# EAGLE design SMARTBALL_v2.1 (EAGLE 9.6.2)
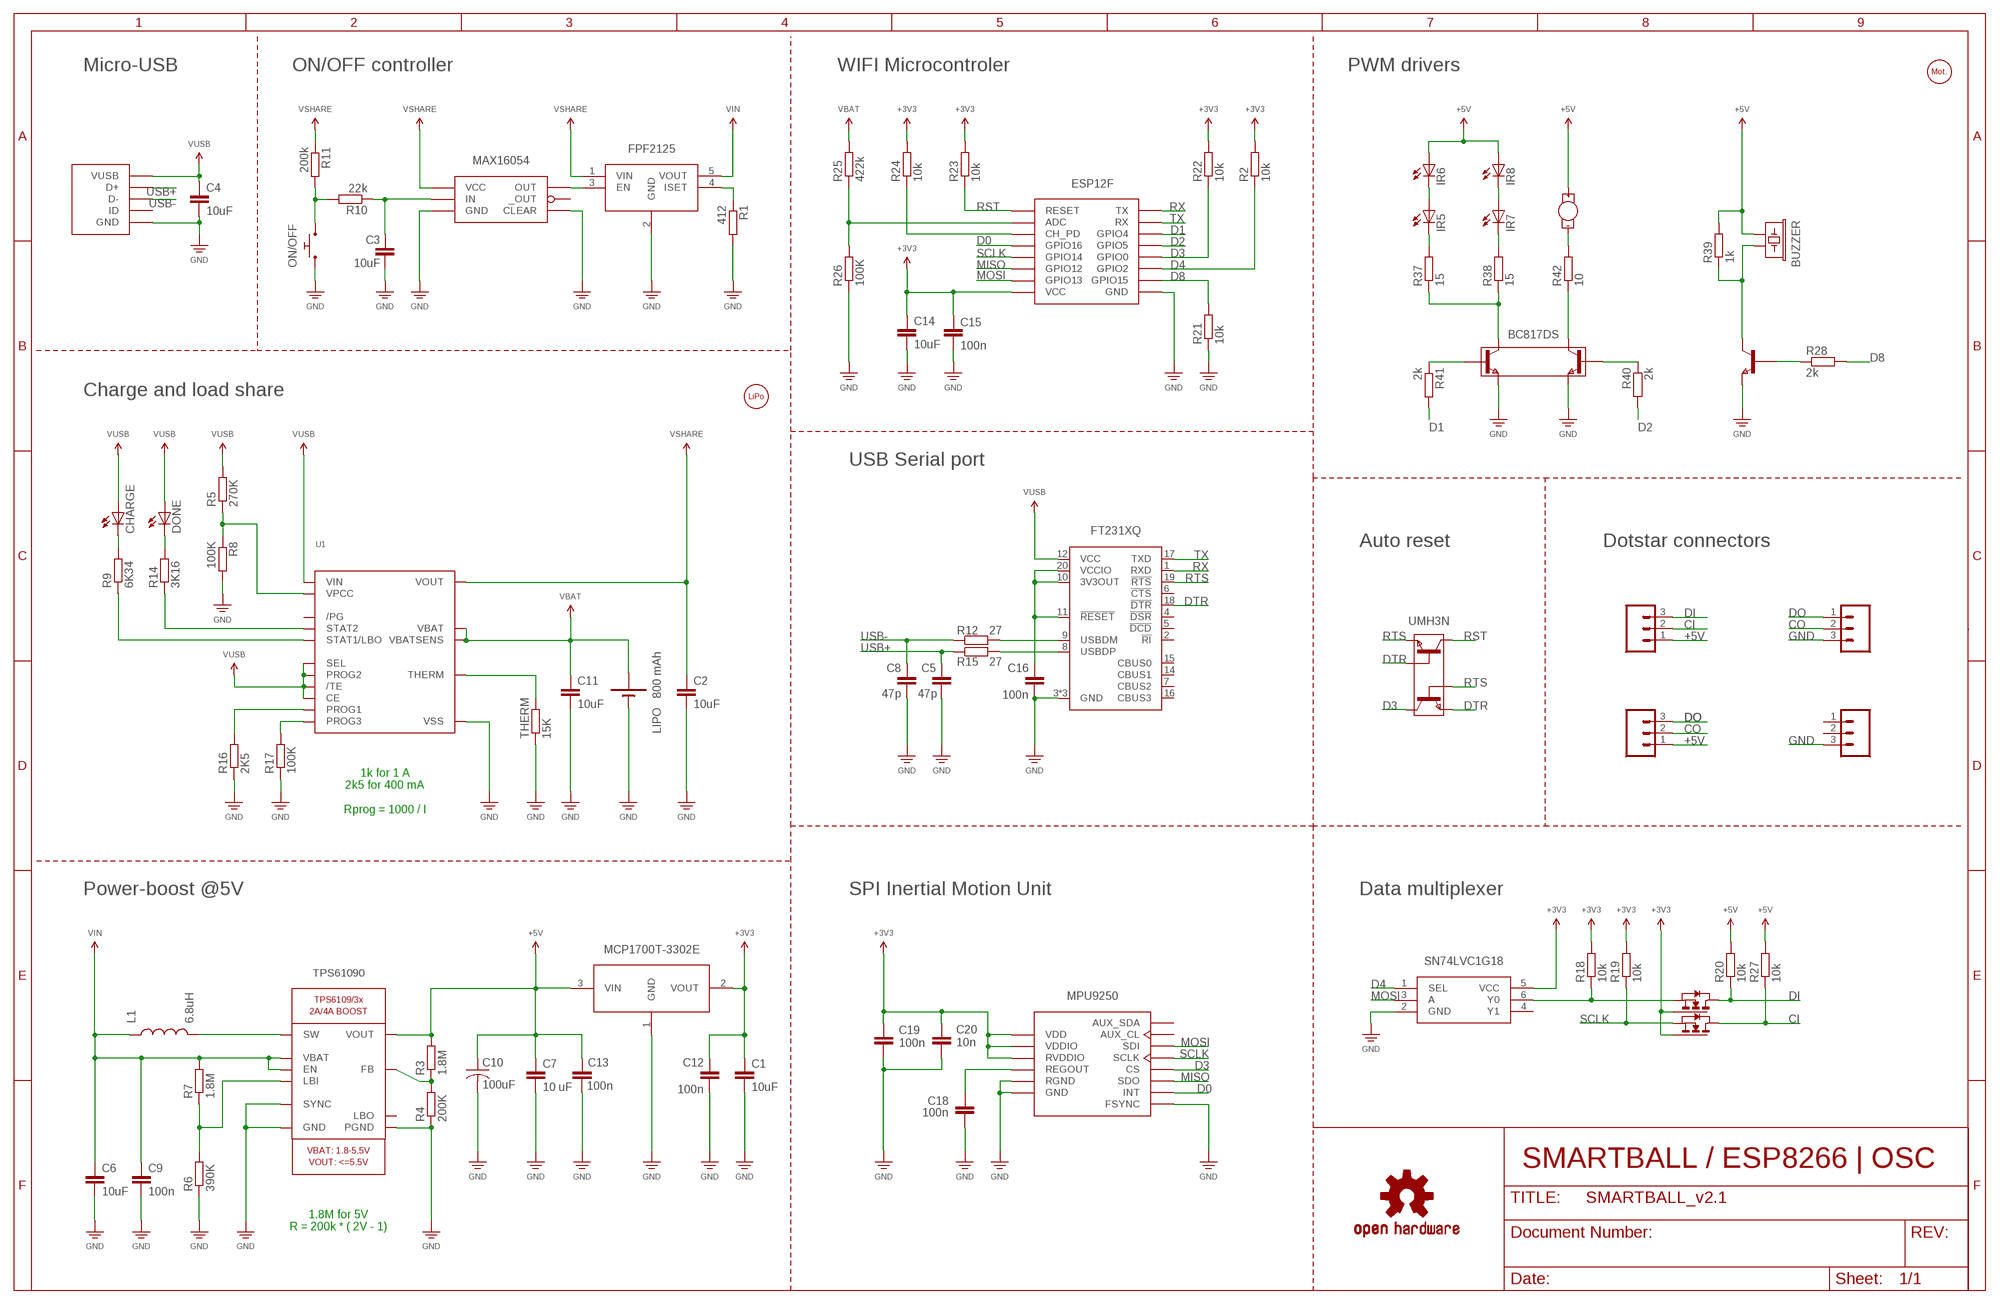
[diagram p0: schematic, sheet 1]

## Parts
BC817DS  SOT_BC817DS  [SOT457R_PHILIPS]
BUZZER  BUZZER_PKMCS0909E4000-R1  [BUZZER_PKMCS0909E4000-R1]
C1  10uF  CAP_CERAMICC0603K  [C0603]
C2  10uF  CAP_CERAMICC0603K  [C0603]
C3  10uF  CAP_CERAMICC0603K  [C0603]
C4  10uF  CAP_CERAMICC0603K  [C0603]
C5  47p  CAP_CERAMICC0603K  [C0603]
C6  10uF  CAP_CERAMICC0603K  [C0603]
C7  10 uF  CAP_CERAMICC0603K  [C0603]
C8  47p  CAP_CERAMICC0603K  [C0603]
C9  100n  CAP_CERAMICC0603K  [C0603]
C10  100uF  CAP_TANTALUMC1210  [C1210]
C11  10uF  CAP_CERAMICC0603K  [C0603]
C12  100n  CAP_CERAMICC0603K  [C0603]
C13  100n  CAP_CERAMICC0603K  [C0603]
C14  10uF  CAP_CERAMICC0603K  [C0603]
C15  100n  CAP_CERAMICC0603K  [C0603]
C16  100n  CAP_CERAMICC0603K  [C0603]
C18  100n  CAP_CERAMICC0603K  [C0603]
C19  100n  CAP_CERAMICC0603K  [C0603]
C20  10n  CAP_CERAMICC0603K  [C0603]
CHARGE  LED_KINGBRIGHT_16X08  [LED_KINGBRIGHT_16X08]
DONE  LED_KINGBRIGHT_16X08  [LED_KINGBRIGHT_16X08]
ESP12F  µP_ESP12  [µP_ESP12]
FT231XQ  QFN_FT231X  [QFN20]
IR5  LED_SFH4050  [LED_SFH4050]
IR6  LED_SFH4050  [LED_SFH4050]
IR7  LED_SFH4050  [LED_SFH4050]
IR8  LED_SFH4050  [LED_SFH4050]
L1  6.8uH  IND_ASPIAIG-S4035  [IND_ASPIAIG-S4035]
LIPO  CONN_BATTERY  [CONN_WIRES]
LOGO1  LOGO_OSHWL  [LOGO_OSHW]
MOTOR  CONN_MOTOR  [CONN_WIRES]
ON/OFF  BUT_KMR6  [BUT_KMR6]
R1  412  RES_EUR0402  [R0402]
R2  10k  RES_EUR0402  [R0402]
R3  1.8M  RES_EUR0402  [R0402]
R4  200K  RES_EUR0402  [R0402]
R5  270K  RES_EUR0402  [R0402]
R6  390K  RES_EUR0402  [R0402]
R7  1.8M  RES_EUR0402  [R0402]
R8  100K  RES_EUR0402  [R0402]
R9  6K34  RES_EUR0402  [R0402]
R10  22k  RES_EUR0402  [R0402]
R11  200k  RES_EUR0402  [R0402]
R12  27  RES_EUR0402  [R0402]
R14  3K16  RES_EUR0402  [R0402]
R15  27  RES_EUR0402  [R0402]
R16  2K5  RES_EUR0402  [R0402]
R17  100K  RES_EUR0402  [R0402]
R18  10k  RES_EUR0402  [R0402]
R19  10k  RES_EUR0402  [R0402]
R20  10k  RES_EUR0402  [R0402]
R21  10k  RES_EUR0402  [R0402]
R22  10k  RES_EUR0402  [R0402]
R23  10k  RES_EUR0402  [R0402]
R24  10k  RES_EUR0402  [R0402]
R25  422k  RES_EUR0402  [R0402]
R26  100K  RES_EUR0402  [R0402]
R27  10k  RES_EUR0402  [R0402]
R28  2k  RES_EUR0402  [R0402]
R37  15  RES_EUR0402  [R0402]
R38  15  RES_EUR0402  [R0402]
R39  1k  RES_EUR0402  [R0402]
R40  2k  RES_EUR0402  [R0402]
R41  2k  RES_EUR0402  [R0402]
R42  10  RES_EUR0402  [R0402]
THERM  15K  RES_EUR0402  [R0402]
TPS61090  TPS61090RSAR  QFN_TPS6103X  [QFN16]
U1  QFN_MCP73871  [QFN20]
U$1  CONN_USB  [CONN_USB]
U$2  SOT_FPF2125  [SOT23-5]
U$3  SOT_MCP1700T  [SOT23-3]
U$5  CONN_03_SMD  [CONN_03_SMD]
U$6  CONN_03_SMD  [CONN_03_SMD]
U$12  SOT_MAX16054  [TSOT23-6]
U$14  CONN_03_SMD  [CONN_03_SMD]
U$15  CONN_03_SMD  [CONN_03_SMD]
U$19  MOTOR_BODY  [MOTOR_BODY]
U$20  SOT_SN74LVC1G18  [SOT363]
U$21  QFN_MPU-9250QFN24G  [QFN24_3MM]
U$22  SOT_2N7002PS  [SOT363]
U$28  SOT_SBC847AWT1G  [SOT323]
U$29  BATT_BODY  [BATT_BODY]
UMH3N  SOT_UMH3N  [SOT363]

## Nets
+3V3 [+3v3]: C1.1 C12.1 C14.1 C15.1 C19.1 C20.2 ESP12F.VCC R2.2 R18.2 R19.2 R22.2 R23.2 R24.2 U$3.2(VOUT) U$20.5(VCC) U$21.1(RVDDIO) U$21.8(VDDIO) U$21.13(VDD) U$22.2(G1) U$22.5(G2)
+5V [power]: BUZZER.1 C7.1 C10.1 C13.1 IR6.1(A) IR8.1(A) MOTOR.VCC(+) R3.2 R20.2 R27.2 R39.2 TPS61090.1(VOUT) TPS61090.15(VOUT) TPS61090.16(VOUT) U$3.3(VIN) U$5.1 U$15.1
ADC: ESP12F.ADC R25.1 R26.2
B1: BC817DS.5(B2) R41.1
B2: BC817DS.2(B1) R40.1
B3: R28.1 U$28.1(B)
C1: BC817DS.3(C2) R37.1 R38.1
C2: BC817DS.6(C1) R42.1
C3: BUZZER.2 R39.1 U$28.3(C)
CI: R27.1 U$5.2 U$22.3(D2)
CO: U$6.2 U$15.2
D0: ESP12F.GPIO16 U$21.12(INT)
D1: ESP12F.GPIO4 R41.2
D2: ESP12F.GPIO5 R40.2
D3: ESP12F.GPIO0 R22.1 U$21.22(CS) UMH3N.3(C2)
D4: ESP12F.GPIO2 R2.1 U$20.1(SEL)
D8: ESP12F.GPIO15 R21.2 R28.2
DI: R20.1 U$5.3 U$22.6(D1)
DO: U$6.1 U$15.3
DTR: FT231XQ.18(!DTR) UMH3N.2(B1) UMH3N.4(E2)
EN: U$2.3(EN) U$12.5(OUT)
EN1: ESP12F.CH_PD R24.1
FB: R3.1 R4.2 TPS61090.14(FB)
GND [power]: BC817DS.1(E1) BC817DS.4(E2) C1.2 C2.2 C3.2 C4.2 C5.2 C6.2 C7.2 C8.2 C9.2 C10.2 C11.2 C12.2 C13.2 C14.2 C15.2 C16.2 C18.2 C19.2 C20.1 ESP12F.GND FT231XQ.3(GND) FT231XQ.13(GND) FT231XQ.EXP(GND) LIPO.GND ON/OFF.1 ON/OFF.4 R1.2 R4.1 R6.1 R8.2 R16.1 R17.1 R21.1 R26.1 THERM.1 TPS61090.5(PGND) TPS61090.6(PGND) TPS61090.7(PGND) TPS61090.10(SYNC) TPS61090.13(GND) TPS61090.PAD(PGND) U1.10(VSS) U1.11(VSS) U1.EXP(VSS) U$1.GND U$1.P$1(GND) U$1.P$11(GND) U$1.SHELL1(GND) U$1.SHELL2(GND) U$1.SHELL5(GND) U$1.SHELL6(GND) U$2.2(GND) U$3.1(GND) U$6.3 U$12.2(GND) U$12.3(CLEAR) U$14.3 U$20.2(GND) U$21.11(FSYNC) U$21.18(GND) U$21.20(RGND) U$28.2(E)
IN: C3.1 R10.1 U$12.1(IN)
IR1: IR5.2(C) R37.2
IR2: IR5.1(A) IR6.2(C)
IR3: IR7.1(A) IR8.2(C)
IR4: IR7.2(C) R38.2
ISET: R1.1 U$2.4(ISET)
LBI: R6.2 R7.1 TPS61090.9(LBI)
LED1: DONE.2(C) R14.2
LED2: CHARGE.2(C) R9.2
MISO: ESP12F.GPIO12 U$21.9(SDO)
MOSI: ESP12F.GPIO13 U$20.3(A) U$21.24(SDI)
MOT: MOTOR.GND(-) R42.2
ON/OFF: ON/OFF.2 ON/OFF.3 R10.2 R11.2
PROG1: R16.2 U1.13(PROG1)
PROG3: R17.2 U1.12(PROG3)
REGOUT1: C18.1 U$21.10(REGOUT)
RST: ESP12F.RESET R23.1 UMH3N.6(C1)
RTS: FT231XQ.19(!RTS) UMH3N.1(E1) UMH3N.5(B2)
RX: ESP12F.TX FT231XQ.1(RXD)
SCLK: ESP12F.GPIO14 R19.1 U$21.23(SCLK) U$22.4(S2)
STAT1: R9.1 U1.8(STAT1/LBO)
STAT2: R14.1 U1.7(STAT2)
SW: L1.2 TPS61090.3(SW) TPS61090.4(SW)
THERM: THERM.2 U1.5(THERM)
TX: ESP12F.RX FT231XQ.17(TXD)
USB+: C5.1 R15.1 U$1.D+
USB-: C8.1 R12.1 U$1.D-
USBDM: FT231XQ.9(USBDM) R12.2
USBDP: FT231XQ.8(USBDP) R15.2
VBAT [power]: C11.1 LIPO.VCC(VBAT) R25.2 U1.14(VBAT) U1.15(VBAT) U1.16(VBATSENS)
VCCIO1: C16.1 FT231XQ.10(3V3OUT) FT231XQ.11(!RESET) FT231XQ.20(VCCIO)
VIN [power]: C6.1 C9.1 L1.1 R7.2 TPS61090.8(VBAT) TPS61090.11(EN) U$2.5(VOUT)
VPCC: R5.1 R8.1 U1.2(VPCC)
VSHARE [power]: C2.1 R11.1 U1.1(VOUT) U1.20(VOUT) U$2.1(VIN) U$12.6(VCC)
VUSB [power]: C4.1 CHARGE.1(A) DONE.1(A) FT231XQ.12(VCC) R5.2 U1.3(SEL) U1.4(PROG2) U1.9(/TE) U1.17(CE) U1.18(VIN) U1.19(VIN) U$1.VUSB
Y0: R18.1 U$20.6(Y0) U$22.1(S1)
Unconnected: FT231XQ.2(!RI) FT231XQ.4(!DSR) FT231XQ.5(!DCD) FT231XQ.6(!CTS) FT231XQ.7(CBUS2) FT231XQ.14(CBUS1) FT231XQ.15(CBUS0) FT231XQ.16(CBUS3) TPS61090.12(LBO) U1.6(/PG) U$1.ID U$12.4(_OUT) U$14.1 U$14.2 U$20.4(Y1) U$21.7(AUX_CL) U$21.21(AUX_SDA)

## Notes on the sheet
- Micro-USB | ON/OFF controller | WIFI Microcontroler | PWM drivers
- FPF2125
- MAX16054
- Charge and load share
- USB Serial port
- Auto reset | Dotstar connectors
- 800 mAh
- 1k for 1 A
  2k5 for 400 mA
  
  Rprog = 1000 / I
- Power-boost @5V | SPI Inertial Motion Unit | Data multiplexer
- MCP1700T-3302E
- SN74LVC1G18
- SMARTBALL / ESP8266 | OSC
- 1.8M for 5V
  R = 200k * ( 2V - 1)

## Library data of the parts
BC817DS = Smartball:SOT_BC817DS: Dual NPN Transistor
BUZZER = Smartball:BUZZER_PKMCS0909E4000-R1: Piezzo Buzzer
C1-C9 C11-C16 C18-C20 = Smartball:CAP_CERAMIC: Ceramic Capacitor; SPICEPREFIX: C
C10 = Smartball:CAP_TANTALUM: Tantalum Capacitor
CHARGE DONE = Smartball:LED_KINGBRIGHT_16X08: SMD Color LED
ESP12F = Smartball:µP_ESP12: ESP8266 Wifi module 12F
FT231XQ = Smartball:QFN_FT231X: Serial USB Interface
IR5-IR8 = Smartball:LED_SFH4050: 850 nm High Power IR Led from OSRAM
L1 = Smartball:IND_ASPIAIG-S4035: Inductor
LIPO = Smartball:CONN_BATTERY: LIPO PCB Connector
LOGO1 = Smartball:LOGO_OSHW: Open-Source Hardware (OSHW) Logo This logo indicates the piece of hardware it is found on incorporates a OSHW license and/or adheres to the definition of open source hardware found here: http://freedomdefined.org/OSHW
MOTOR = Smartball:CONN_MOTOR: Motor PCB Connector
ON/OFF = Smartball:BUT_KMR6: Momentary Switch
R1-R12 R14-R28 R37-R42 THERM = Smartball:RES_EU: Resistor; SPICEPREFIX: R
TPS61090 = Smartball:QFN_TPS6103X: Power Booster 1.8-5.5V Input, Adjustable Output to 5.5V
U1 = Smartball:QFN_MCP73871: Lithium Polymer Battery Charger
U$1 = Smartball:CONN_USB: Micro USB Connector
U$2 = Smartball:SOT_FPF2125: Overcurrent Protection
U$3 = Smartball:SOT_MCP1700T: 3.3V Voltage Regulator
U$5 U$6 U$14 U$15 = Smartball:CONN_03_SMD: SMD 3-Pin Connector
U$12 = Smartball:SOT_MAX16054: Smart On/Off Controller
U$19 = Smartball:MOTOR_BODY: Motor Body
U$20 = Smartball:SOT_SN74LVC1G18: 1 Channel Multiplexer
U$21 = Smartball:QFN_MPU-9250: MPU-9250 Invensense IMU Chipset
U$22 = Smartball:SOT_2N7002PS
U$28 = Smartball:SOT_SBC847AWT1G: NPN Transistor
U$29 = Smartball:BATT_BODY: Battery Body
UMH3N = Smartball:SOT_UMH3N: Autoreset dual-channel NPN Transistor

## Net classes
0 default: width 0.152 mm
1 power: width 0.254 mm
2 +3v3: width 0.203 mm

## Board
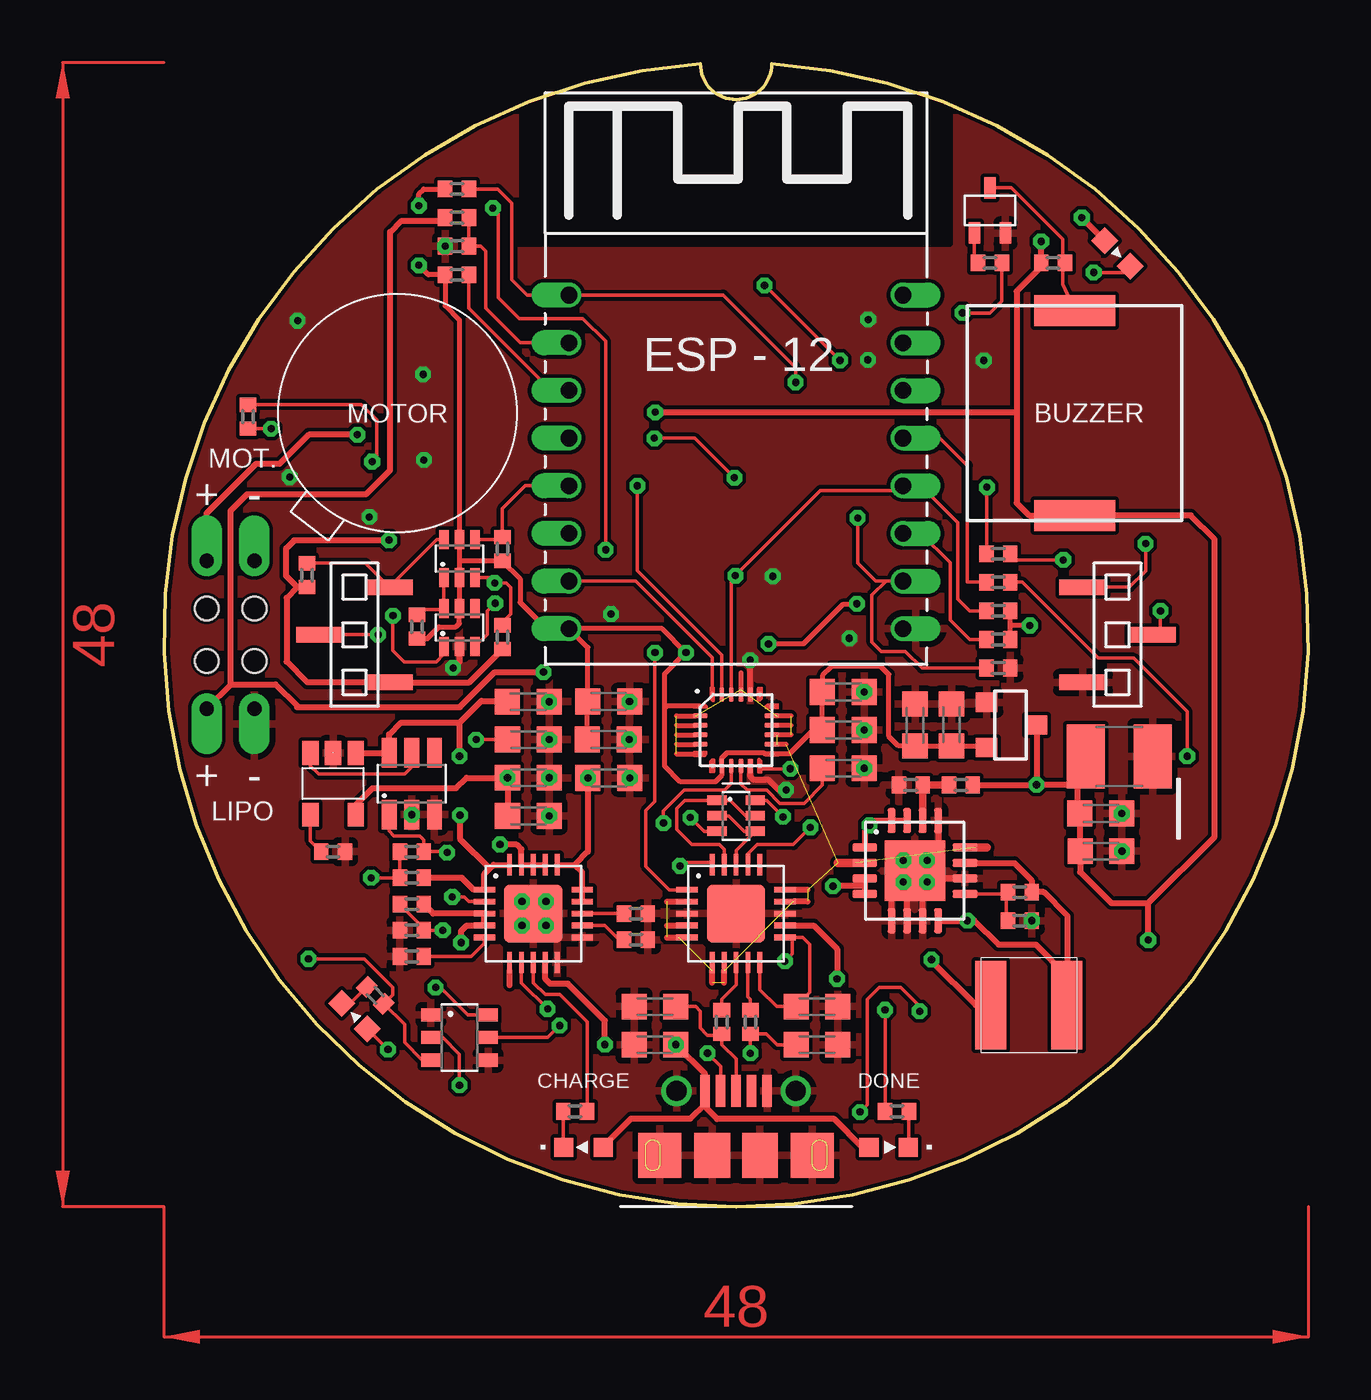
[diagram p1: board, top side]
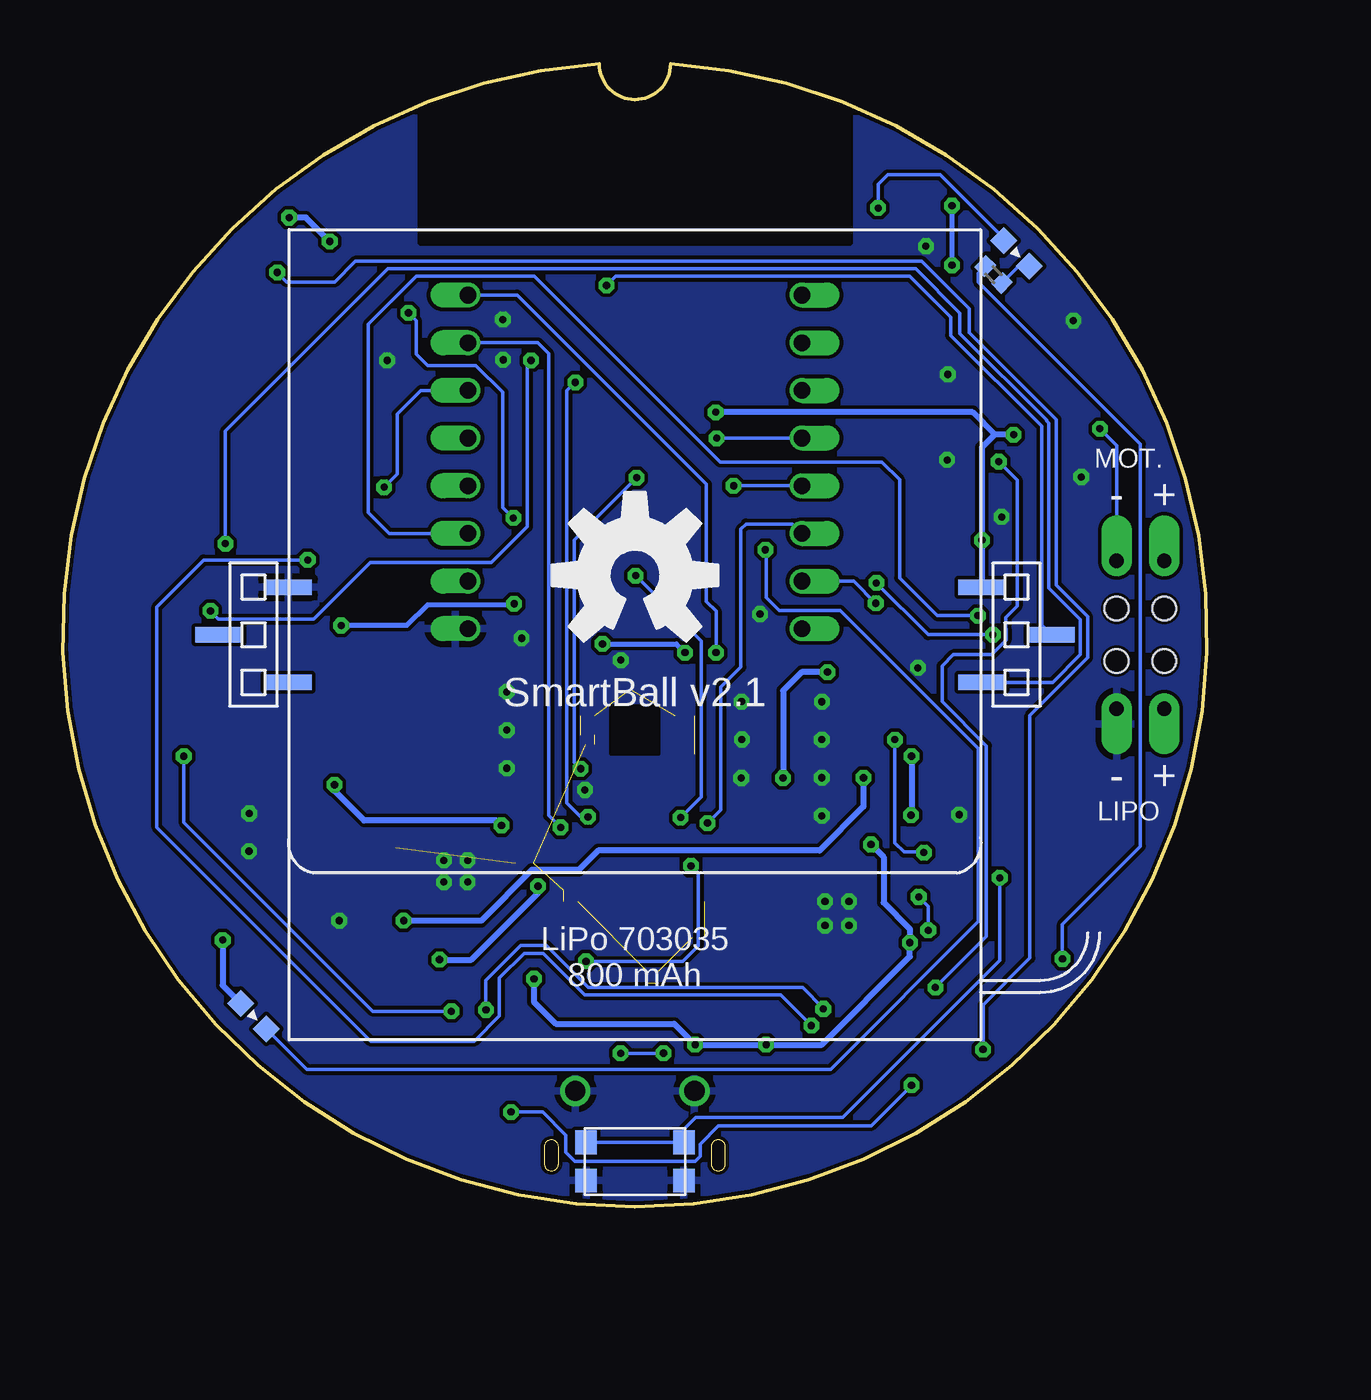
[diagram p2: board, bottom side, seen from below]

Size 47.98 x 47.96 mm. Coordinates in mm from the lower left corner, seen from the top.
Outline: 22.5,47.96 arc353 25.49,47.96 arc-180 22.5,47.96
Copper layers (1*16): Top 0.035mm / dielectric 1.5mm / Bottom 0.035mm
Design rules "PCBWay-LIMIT *": minimum track width 6mil, minimum drill 0.3mm, track to track 6mil, track to pad 6mil, pad to pad 6mil, via to via 6mil, smd to smd 6mil, copper to edge 6mil, drill to drill 6mil, minimum pad ring 7mil, minimum via ring 7mil, stop-mask expansion 4mil, vias tented up to drill 25mil, thermal gap 10mil

### Footprints (pad centres in the part's own frame; a part is rotated, then mirrored left to right if it is on the bottom)
SOT457R_PHILIPS = smd 0.55 x 0.8: 1 -0.95,-1.2; 2 0,-1.2; 3 0.95,-1.2; 4 0.95,1.2; 5 0,1.2; 6 -0.95,1.2
BUZZER_PKMCS0909E4000-R1 = smd 1.3 x 3.4: 1 -4.3,0; 2 4.3,0
C0603 = smd 1.05 x 1.08: 1 -0.875,0; 2 0.875,0
C1210 = smd 1.6 x 2.7: 1 -1.4,0; 2 1.4,0
LED_KINGBRIGHT_16X08 = smd 0.8 x 0.8: 1 -0.825,0; 2 0.825,0
µP_ESP12 = drill 0.7 offset: ADC -7,3.8; CH_PD -7,1.8; GND 7,-8.2; GPIO0 7,-2.2; GPIO2 7,-4.2; GPIO4 7,1.8; GPIO5 7,-0.2; GPIO12 -7,-4.2; GPIO13 -7,-6.2; GPIO14 -7,-2.2; GPIO15 7,-6.2; GPIO16 -7,-0.2; RESET -7,5.8; RX 7,3.8; TX 7,5.8; VCC -7,-8.2
QFN20 = smd 0.95 x 0.25: 1 -2.05,1; 2 -2.05,0.5; 3 -2.05,0; 4 -2.05,-0.5; 5 -2.05,-1; 11 2.05,-1; 12 2.05,-0.5; 13 2.05,0; 14 2.05,0.5; 15 2.05,1 | smd 0.25 x 0.9: 6 -1,-2.05; 7 -0.5,-2.05; 8 0,-2.05; 9 0.5,-2.05; 10 1,-2.05; 16 1,2.05; 17 0.5,2.05; 18 0,2.05; 19 -0.5,2.05; 20 -1,2.05 | smd 2.45 x 2.45: EXP 0,0
LED_SFH4050 = smd 0.8 x 0.8: 1 -0.75,0; 2 0.75,0
IND_ASPIAIG-S4035 = smd 1.3 x 3.7: 1 -1.6,0; 2 1.6,0
CONN_WIRES = drill 0.6 pad 1.27 offset: GND 1,0; VCC -1,0 | hole 1: -1,-2; 1,-2
BUT_KMR6 = smd 0.9 x 1: 1 -2.05,0.8; 2 -2.05,-0.8; 3 2.05,-0.8; 4 2.05,0.8
R0402 = smd 0.6 x 0.7: 1 -0.5,0; 2 0.5,0
QFN16 = smd 1.05 x 0.35: 1 -2.1,0.975; 2 -2.1,0.325; 3 -2.1,-0.325; 4 -2.1,-0.975; 9 2.1,-0.975; 10 2.1,-0.325; 11 2.1,0.325; 12 2.1,0.975 | smd 0.35 x 1.05: 5 -0.975,-2.1; 6 -0.325,-2.1; 7 0.325,-2.1; 8 0.975,-2.1; 13 0.975,2.1; 14 0.325,2.1; 15 -0.325,2.1; 16 -0.975,2.1 | smd 2.54 x 2.54: PAD 0,0
CONN_USB = smd 0.4 x 1.35: D+ 0,2.7; D- -0.65,2.7; GND 1.3,2.7; ID 0.65,2.7; VUSB -1.3,2.7 | smd 1.8 x 1.9: P$1 -3.2,0; P$11 3.2,0 | drill 0.85: SHELL1 -2.5,2.7; SHELL2 2.5,2.7 | smd 1.5 x 1.9: SHELL5 -1,0; SHELL6 1,0
SOT23-5 = smd 0.69 x 0.99: 1 -0.95,-1.29; 2 0,-1.29; 3 0.95,-1.29; 4 0.95,1.3; 5 -0.95,1.3
SOT23-3 = smd 0.8 x 0.9: 1 -0.95,-1; 2 0.95,-1; 3 0,1.1
CONN_03_SMD = smd 0.65 x 2: 1 -2,-1.45; 2 0,1.45; 3 2,-1.45
TSOT23-6 = smd 0.62 x 1.22: 1 -0.95,-1.3; 2 0,-1.3; 3 0.95,-1.3; 4 0.95,1.3; 5 0,1.3; 6 -0.95,1.3
SOT363 = smd 0.4 x 0.8: 1 -0.65,-0.8; 2 0,-0.8; 3 0.65,-0.8; 4 0.65,0.8; 5 0,0.8; 6 -0.65,0.8
QFN24_3MM = smd 0.2 x 0.15: 1 -1.5,1; 6 -1.5,-1; 13 1.5,-1; 18 1.5,1 | smd 0.6 x 0.2: 2 -1.5,0.6; 3 -1.5,0.2; 4 -1.5,-0.2; 5 -1.5,-0.6; 14 1.5,-0.6; 15 1.5,-0.2; 16 1.5,0.2; 17 1.5,0.6 | smd 0.15 x 0.2: 7 -1,-1.5; 12 1,-1.5; 19 1,1.5; 24 -1,1.5 | smd 0.2 x 0.6: 8 -0.6,-1.5; 9 -0.2,-1.5; 10 0.2,-1.5; 11 0.6,-1.5; 20 0.6,1.5; 21 0.2,1.5; 22 -0.2,1.5; 23 -0.6,1.5
SOT323 = smd 0.5 x 0.9: 1 -0.65,-0.95; 2 0.65,-0.95; 3 0,0.95

### Placement (x,y rotation side)
BC817DS  12.39,7.11 270 top
BUZZER  38.19,33.31 90 top
C1  33.03,20.23 90 top
C2  15.28,21.2 0 top
C3  15.28,19.61 0 top
C4  20.59,6.81 180 top
C5  20.59,8.41 180 top
C6  15.28,16.41 0 top
C7  39.29,16.51 0 top
C8  27.39,6.81 0 top
C9  15.28,18.01 0 top
C10  40.06,18.9 0 top
C11  18.66,18 0 top
C12  31.5,20.22 90 top
C13  39.3,14.93 0 top
C14  18.63,19.61 0 top
C15  18.65,21.2 0 top
C16  27.39,8.41 0 top
C18  28.49,18.41 0 top
C19  28.49,20.01 0 top
C20  28.49,21.61 180 top
CHARGE  17.59,2.51 180 top
DONE  30.39,2.51 0 top
ESP12F  23.99,32.46 0 top
FT231XQ  23.99,12.31 0 top
IR5  7.99,8.01 135 top
IR6  39.99,40.01 315 top
IR7  7.99,40.01 315 bottom
IR8  39.99,8.01 315 bottom
L1  36.27,8.47 180 top
LIPO  2.79,20.91 180 bottom
LOGO1  23.99,26.51 0 bottom
MOTOR  2.79,27.11 0 top
ON/OFF  23.99,1.91 180 bottom
R1  7.09,14.91 0 top
R2  34.99,23.81 0 top
R3  33.42,17.71 0 top
R4  31.32,17.71 0 top
R5  10.39,12.71 0 top
R6  35.89,12.01 180 top
R7  35.89,13.21 0 top
R8  10.39,11.61 180 top
R9  17.24,4.01 180 top
R10  10.39,14.91 180 top
R11  10.39,13.81 180 top
R12  24.59,7.76 90 top
R14  30.74,4.01 0 top
R15  23.39,7.76 90 top
R16  19.79,12.31 180 top
R17  19.79,11.21 180 top
R18  10.61,24.35 270 top
R19  14.19,27.61 270 top
R20  5.99,26.51 270 top
R21  34.99,22.61 180 top
R22  34.99,25.01 0 top
R23  12.29,42.71 180 top
R24  12.29,39.11 180 top
R25  12.29,41.51 180 top
R26  12.29,40.31 0 top
R27  14.19,23.91 270 top
R28  34.64,39.61 0 top
R37  8.86,8.88 135 top
R38  8.95,39.12 315 bottom
R39  37.29,39.61 180 top
R40  34.99,26.21 180 top
R41  34.99,27.41 180 top
R42  3.52,33.16 270 top
THERM  10.39,10.51 0 top
TPS61090  31.49,14.11 0 top
U1  15.49,12.31 0 top
U$1  23.99,2.17 0 top
U$2  7.09,17.76 180 top
U$3  35.5,20.23 270 top
U$5  7.99,24.01 90 top
U$6  39.99,24.01 270 top
U$12  10.39,17.76 0 top
U$14  39.99,24.01 90 bottom
U$15  7.99,24.01 270 bottom
U$19  9.79,33.31 0 top
U$20  12.39,24.31 0 top
U$21  23.99,20.01 0 top
U$22  12.39,27.21 0 top
U$28  34.64,41.81 0 top
U$29  23.99,24.01 0 bottom
UMH3N  23.99,16.41 270 top

### Tracks (layer width: path | path; a pad name or v marks a point on that pad's centre or on a via)
+3V3  (via drill 0.3, 0.3 pad 0.55)
  Top 0.203: U$21.13 26.23,19.01 27.23,20.01 C19.1 C20.2 27.62,22.3 28,22.68 30.06,22.68 30.4,22.34 30.4,19.74 30.8,19.34 C12.1 C1.1 34.42,19.35 U$3.2 | R2.2 35.49,24.4 | 35.49,24.4 R22.2 | 12.39,27.11 U$22.5 12.39,37.21 11.79,37.81 R24.2 11.09,39.11 v10.69,39.51 | 12.39,27.11 U$22.2 U$20.5 12.39,24.49 12.24,24.34 11.53,24.34 11.05,23.85 R18.2 | v29.06,25.31 29.02,25.27 28.46,25.27 26.82,23.62 v25.35,23.62 | v10.69,42.01 10.69,42.51 10.89,42.71 R23.2 | 20.99,20.91 20.99,18.51 21.66,17.84 23.12,17.84 23.39,18.11 U$21.8 23.39,18.84 23.62,19.07 25.15,19.07 25.21,19.01 U$21.13 | 20.99,20.91 20.99,22.36 v21.89,23.26 20.89,24.26 ESP12F.VCC | 20.99,20.91 21.09,21.01 U$21.1 | 12.39,27.11 R19.2 14.94,26.36 14.94,25.36 16.04,24.26 ESP12F.VCC | ESP12F.VCC 17.77,23.48 C15.1 17.76,21.19 C14.1 | v36.31,24.4 35.49,24.4 | U$21.13
  Bottom 0.203: v29.06,25.31 29.11,25.26 32.69,25.26 33.55,24.4 v36.31,24.4 | v25.35,23.62 22.25,23.62 v21.89,23.26 | v10.69,39.51 v10.69,42.01
+5V  (via drill 0.3, 0.3 pad 0.55)
  Top 0.254: 35.76,33.31 35.76,38.42 36.79,39.45 R39.2 v36.79,40.51 | 35.76,33.31 35.76,29.54 36.29,29.01 BUZZER.1 43.07,29.01 44.06,28.02 44.06,15.53 41.28,12.75 | 29.61,16 29.39,15.77 TPS61090.1 | 29.61,16 29.83,16.21 TPS61090.16 TPS61090.15 | v38.49,41.51 IR6.1 | IR6.1 | 29.61,16 v29.6,16.01 v29.59,16.01 | R27.2 14.23,23.37 14.17,23.37 12.81,22.01 U$5.1 6.01,22.01 5.14,22.88 5.14,25.56 5.59,26.01 | R20.2 5.59,26.01 | 5.59,26.01 5.12,26.48 5.12,27.63 5.46,27.97 9.43,27.97 v9.44,27.98 | MOTOR.VCC 1.79,29.11 3.85,31.17 4.84,31.17 6.07,32.4 v8.11,32.4 | U$3.3 v36.6,17.73 v36.59,17.72 | R3.2 v36.58,17.71 v36.59,17.72 | v36.59,17.72 38.33,17.72 | C10.1 38.66,18.05 38.33,17.72 | 38.33,17.72 38.33,16.6 C7.1 38.42,14.94 C13.1 38.43,14.05 39.73,12.75 41.28,12.75 | v41.28,11.2 41.28,12.75 | v20.6,33.34 35.72,33.34 35.76,33.31
  Bottom 0.254: v36.79,40.51 37.79,41.51 v38.49,41.51 | v41.28,11.2 41.28,9.3 IR8.1 | U$15.1 v9.44,27.98 9.44,31.86 8.9,32.4 | v8.11,32.4 8.9,32.4 | 8.9,32.4 8.89,32.41 9.83,33.34 v20.6,33.34 | v29.59,16.01 29.79,16.21 35.35,16.21 36.59,17.45 v36.59,17.72
ADC
  Top 0.152: R25.1 R26.2 13.29,40.31 13.49,40.11 13.49,37.71 14.94,36.26 ESP12F.ADC
B1  (via drill 0.3 pad 0.55)
  Top 0.152: BC817DS.5 16.09,7.11 v16.59,7.61 | v37.71,27.15 35.75,27.15 R41.1
  Bottom 0.152: v16.59,7.61 17.88,8.9 26.09,8.9 27.83,10.65 28.64,10.65 29.67,9.61 29.67,8.01 30.73,6.95 35.06,6.95 44.04,15.93 44.04,25.18 42.08,27.15 v37.71,27.15
B2  (via drill 0.3 pad 0.55)
  Top 0.152: BC817DS.2 11.69,7.11 12.39,6.41 v12.39,5.11 | v29.19,3.99 29.49,4.29 29.49,8.71 29.99,9.21 30.89,9.21 31.69,8.41 v31.69,8.21 | v42.91,18.91 42.91,20.79 40.67,23.03 39.18,23.03 36,26.21 R40.1
  Bottom 0.152: v12.39,5.11 14.09,3.41 20.49,3.41 21.26,2.64 21.26,2.11 21.47,1.91 26.51,1.91 26.89,2.29 26.89,3.01 27.87,3.99 v29.19,3.99 | v31.69,8.21 34.98,8.21 42.91,16.14 v42.91,18.91
B3
  Top 0.152: R28.1 33.99,39.76 U$28.1
C1  (via drill 0.3 pad 0.55)
  Top 0.152: BC817DS.3 10.84,6.16 10.09,6.91 10.09,7.65 R37.1 9.59,8.9 9.59,9.21 8.39,10.41 v6.06,10.41
  Bottom 0.152: R38.1 9.59,39.19 9.59,38.81 2.79,32.01 2.79,15.13 6.06,11.86 v6.06,10.41
C2  (via drill 0.3 pad 0.55)
  Top 0.152: BC817DS.6 12.74,8.06 11.59,9.21 v11.39,9.21 | v8.73,31.27 8.92,31.46 8.92,33.03 8.28,33.66 R42.1
  Bottom 0.152: v11.39,9.21 9.25,11.35 9.25,19.34 11.11,21.21 11.11,22.7 10.64,23.17 9.03,23.17 8.42,23.78 8.42,24.24 8.43,24.25 8.43,24.74 7.96,25.21 7.96,30.5 v8.73,31.27
C3
  Top 0.152: R39.1 37.69,39.71 | 37.69,39.71 37.69,40.61 35.54,42.76 U$28.3 | BUZZER.2 37.69,38.71 37.69,39.71
CI  (via drill 0.3 pad 0.55)
  Top 0.152: R27.1 14.19,24.52 14.55,24.88 14.55,25.99 14.35,26.18 v13.87,26.18 13.64,26.41 U$22.3 | v8.98,24.01 U$5.2
  Bottom 0.152: v13.87,26.18 11.69,24.01 v8.98,24.01
CO  (via drill 0.3 pad 0.55)
  Top 0.152: v28.35,35.52 25.2,38.67 v25.18,38.67 | U$6.2 41.79,24.01 v41.79,25.01
  Bottom 0.152: v41.79,25.01 41.46,24.68 37.45,24.68 35.1,27.03 30.02,27.03 28.51,28.54 28.51,35.36 v28.35,35.52 | v25.18,38.67 24.8,39.05 12.47,39.05 10.75,37.33 10.75,36.57 6.94,32.76 6.94,24.41 U$15.2
D0  (via drill 0.3 pad 0.55)
  Top 0.152: v23.92,30.6 22.26,32.26 v20.56,32.26 | v26.27,18.39 25.11,18.39 U$21.12
  Bottom 0.152: v26.27,18.39 26.53,18.65 26.53,27.99 v23.92,30.6 | v20.56,32.26 ESP12F.GPIO16
D1  (via drill 0.3)
  Top 0.152: v34.51,30.2 34.51,27.43 R41.2
  Bottom 0.152: ESP12F.GPIO4 32.97,34.26 33.97,33.26 33.97,30.74 v34.51,30.2
D2
  Top 0.152: R40.2 33.69,26.21 33.69,31.11 32.54,32.26 ESP12F.GPIO5
D3  (via drill 0.3 pad 0.55)
  Top 0.152: R22.1 33.79,25.01 33.29,25.51 33.29,28.71 31.69,30.31 30.94,30.31 ESP12F.GPIO0 30.69,30.06 27.53,30.06 v23.96,26.49 23.79,26.32 U$21.22 | UMH3N.3 22.66,15.76 v22.08,16.34
  Bottom 0.152: v22.08,16.34 21.21,17.21 21.21,23.74 v23.96,26.49
D4  (via drill 0.3 pad 0.55)
  Top 0.152: R2.1 33.79,23.81 32.97,24.63 32.97,27.03 31.74,28.26 ESP12F.GPIO2 | v9.6,24.81 9.6,23.34 10.07,22.87 11.41,22.87 11.74,23.2 U$20.1
  Bottom 0.152: ESP12F.GPIO2 34.3,28.26 35.17,29.13 35.17,37.04 33.16,39.05 28.21,39.05 20.42,31.26 13.64,31.26 12.89,30.51 12.89,26.39 11.31,24.81 v9.6,24.81
D8  (via drill 0.3 pad 0.55)
  Top 0.152: R21.2 31.79,22.61 31.09,23.31 30.08,23.31 29.69,23.7 29.69,25.67 30.28,26.26 | 30.28,26.26 29.84,26.26 29.09,27.01 v29.09,28.91 | 30.28,26.26 ESP12F.GPIO15 | v33.49,37.51 34.64,37.51 35.14,38.01 R28.2
  Bottom 0.152: v29.09,28.91 29.53,29.35 29.53,34.18 30.66,35.31 32.69,35.31 33.16,35.78 33.16,37.18 v33.49,37.51
DI
  Top 0.152: U$22.6 11.44,28.01 U$5.3 8.44,27.01 R20.1
DO  (via drill 0.3 pad 0.55)
  Top 0.152: v41.17,27.83 41.17,26.69 40.49,26.01 U$6.1
  Bottom 0.152: v41.17,27.83 41.17,32.55 34.37,39.36 12.22,39.36 10.36,37.5 10.36,36.64 6.73,33 6.73,32.98 6.63,32.88 6.63,25.97 5.31,24.64 5.31,23.17 6.47,22.01 U$15.3
DTR
  Top 0.152: FT231XQ.18 23.99,14.96 UMH3N.4 24.34,15.76 23.69,16.41 UMH3N.2
EN
  Top 0.152: U$2.3 6.14,18.5 6.48,18.16 10.09,18.16 10.39,18.46 U$12.5
EN1
  Top 0.152: ESP12F.CH_PD 16.79,34.46 16.04,34.46 12.79,37.71 R24.1
FB
  Top 0.305: TPS61090.14 R4.2 R3.1
GND  (via drill 0.3)
  Top 0.254: U$20.2 12.39,22.88 v12.12,22.62 | U$21.20 v24.59,22.94 v24.58,22.94 | TPS61090.10 32.16,13.78 v32,13.63 31.82,13.44 TPS61090.7 | TPS61090.6 31.17,13.47 v31.01,13.63 30.52,13.14 TPS61090.5 | TPS61090.13 32.47,15.01 v32,14.55 | v26.09,17.5 25.78,17.5 25.35,17.93 24.72,17.93 24.59,18.06 U$21.11
  other vias: 11.79,40.31 10.39,16.46 10.87,34.93 10.9,31.34 29.52,35.54 34.38,35.52 8.61,28.95 16.16,19.61 19.51,19.61 19.52,21.2 19.53,18 16.15,21.2 16.16,18.01 16.16,16.41 29.37,21.61 29.37,20.01 29.37,18.41 36.39,12.01 40.17,16.51 40.18,14.93 15.01,12.82 16.02,12.82 16.02,11.81 15.01,11.81 5.6,37.19 5.27,30.63 18.75,24.88 25.53,26.46 28.74,23.86 31.01,14.55 29.53,37.23
  pour Top: -0.01,0.01 47.99,0.01 47.99,48.01 -0.01,48.01
  pour Bottom: -0.01,48.01 -0.01,0.01 47.99,0.01 47.99,48.01
IN  (via drill 0.3 pad 0.55)
  Top 0.152: U$12.1 9.44,15.77 9.64,15.57 10.73,15.57 10.89,15.41 R10.1 11.87,14.91 v11.87,14.87 | v13.09,19.61 C3.1
  Bottom 0.152: v13.09,19.61 13.09,15.28 12.7,14.89 11.89,14.89 v11.87,14.87
IR1
  Top 0.152: IR5.2 7.82,8.54 R37.2
IR2  (via drill 0.3 pad 0.55)
  Top 0.152: IR5.1 v9.39,6.61 | v9.39,6.61 | v38.99,39.21 40.25,39.21 IR6.2
  Bottom 0.152: v38.99,39.21 38.59,38.81 36.59,38.81 35.73,39.67 11.95,39.67 9.98,37.7 9.98,36.69 6.33,33.04 6.33,26.09 5,24.76 5,23.05 7.43,20.62 7.43,10.44 9.39,8.48 v9.39,6.61
IR3  (via drill 0.3 pad 0.55)
  Top 0.152: v13.79,41.91 14.02,41.68 14.02,38.15 14.89,37.28 17.56,37.28 18.52,36.32 v18.52,27.57
  Bottom 0.152: IR8.2 37.76,5.78 15.78,5.78 9.59,11.97 9.59,19.23 15.39,25.02 17.95,25.02 18.48,25.56 18.48,27.53 v18.52,27.57 | v13.79,41.91 13.79,42.91 13.39,43.31 11.19,43.31 8.52,40.64 IR7.1
IR4
  Bottom 0.152: R38.2 7.89,39.48 IR7.2
ISET
  Top 0.152: R1.1 6.14,15.36 U$2.4
LBI
  Top 0.152: TPS61090.9 35.32,13.13 | 35.32,13.13 R7.1 | R6.2 35.32,12.08 35.32,13.13
LED1
  Top 0.152: R14.2 31.24,2.53 DONE.2
LED2
  Top 0.152: R9.2 16.74,2.53 CHARGE.2
MISO  (via drill 0.3 pad 0.55)
  Top 0.152: U$21.9 23.79,17.77 23.51,17.49 21.82,17.49 20.95,16.62 v20.95,16.11
  Bottom 0.152: ESP12F.GPIO12 17.39,28.66 19.32,28.66 19.54,28.44 19.54,22.65 20.39,21.81 20.39,16.67 v20.95,16.11
MOSI  (via drill 0.3 pad 0.55)
  Top 0.152: ESP12F.GPIO13 19.79,26.26 22.99,23.06 U$21.24 | U$20.3 13.56,24.03 13.56,25 v13.89,25.33
  Bottom 0.152: v13.89,25.33 14.82,26.26 ESP12F.GPIO13
MOT  (via drill 0.3 pad 0.55)
  Top 0.152: R42.2 v4.48,32.66 v4.49,32.65
  Bottom 0.152: v4.49,32.65 3.78,31.95 3.78,31.77 3.79,31.77 MOTOR.GND
N$37
  Top 0.254: 14.49,9.31 14.49,9.91
NC  (18 unrouted)
  Top 0.203: 21.49,20.21 22.29,20.21 | 21.49,20.61 22.29,20.61 | 21.49,19.81 22.29,19.81 | 21.49,19.41 22.29,19.41 | 21.49,19.01 22.29,19.01 | 24.19,22.41 24.19,21.71 | 26.08,19.41 25.69,19.41 | 26.29,20.61 25.69,20.61 | 26.29,20.21 25.69,20.21 | 26.29,19.81 25.69,19.81
  Top 0.254: 26.99,12.81 26.39,12.81 | 26.99,13.31 26.39,13.31 | 21.09,12.81 21.59,12.81 | 21.09,11.81 21.59,11.81 | 21.09,11.31 21.59,11.31 | 22.99,9.41 22.99,9.91 | 23.49,9.41 23.49,9.91
  Top 0.351: 34.51,15.08 34.01,15.08 | 28.25,14.43 29,14.43
NOGND
  cutout Bottom: 22.99,21.01 22.99,19.01 25,19.01 25,21.01
  cutout Top: 14.99,48.01 14.99,40.4 32.99,40.4 32.99,48.01
  cutout Bottom: 14.97,48.01 14.97,40.43 32.99,40.43 32.99,48.01
  cutout Top: 22.99,21.02 22.99,19 25,19 25,21.02
ON/OFF  (via drill 0.3 pad 0.55)
  Top 0.152: R10.2 R11.2 v8.69,13.81
  Bottom 0.152: v8.69,13.81 8.69,10.35 15.28,3.76 21.44,3.76 21.94,3.26 ON/OFF.2 ON/OFF.3
PROG1
  Top 0.152: R16.2 U1.13
PROG3
  Top 0.152: R17.2 19.09,11.21 18.49,11.81 U1.12
REGOUT1
  Top 0.152: U$21.10 24.19,17.75 24.45,17.49 25.29,17.49 25.83,16.94 26.85,16.94 27.62,17.71 C18.1
RST  (via drill 0.3 pad 0.55)
  Top 0.152: R23.1 13.99,42.71 14.59,42.11 14.59,38.91 15.24,38.26 ESP12F.RESET 23.45,38.26 26.49,35.22 v26.49,34.6 | v25.96,16.37 25.27,17.06 UMH3N.6
  Bottom 0.152: v26.49,34.6 26.84,34.25 26.84,16.95 26.26,16.37 v25.96,16.37
RTS
  Top 0.152: UMH3N.5 24.39,16.41 23.74,17.06 UMH3N.1 21.84,17.06 21.51,16.73 21.51,15.84 22.14,15.21 23.29,15.21 23.49,15.01 FT231XQ.19
RX  (via drill 0.3 pad 0.55)
  Top 0.152: FT231XQ.1 21.19,13.31 20.21,14.29 20.21,16.63 20.59,17.01 v20.59,23.26
  Bottom 0.152: ESP12F.TX 28.93,38.26 20.99,30.32 20.99,25.41 20.59,25.01 v20.59,23.26
SCLK  (via drill 0.3 pad 0.55)
  Top 0.152: v19.85,30.26 19.85,26.7 23.39,23.16 U$21.23 | U$22.4 14.09,28.01 R19.1 14.19,29.31 15.14,30.26 ESP12F.GPIO14
  Bottom 0.152: ESP12F.GPIO14 v19.85,30.26
STAT1
  Top 0.152: U1.8 15.49,9.41 15.99,8.91 16.59,8.91 17.74,7.76 R9.1
STAT2  (via drill 0.3 pad 0.55)
  Top 0.152: U1.7 14.99,9.41 v16.09,8.31 | v30.24,8.27 R14.1
  Bottom 0.152: v16.09,8.31 16.09,8.34 16.96,9.21 25.94,9.21 27.71,10.98 28.77,10.98 30.24,9.51 v30.24,8.27
SW  (via drill 0.3 pad 0.55)
  Top 0.152: 29.34,13.46 29.39,13.41 | v28.05,13.46
  Top 0.254: TPS61090.3 29.39,13.41 TPS61090.4 | L1.2 34.04,8.47 32.19,10.33 v32.19,10.38 | 29.34,13.46 v28.05,13.46
  Bottom 0.254: v32.19,10.38 30.85,10.38 28.05,13.17 v28.05,13.46
THERM
  Top 0.152: THERM.2 12.89,10.51 13.44,11.06 U1.5
TX  (via drill 0.3 pad 0.55)
  Top 0.152: v27.11,15.92 26.39,15.21 24.89,15.21 24.49,14.81 FT231XQ.17
  Bottom 0.152: ESP12F.RX 28.06,36.26 27.61,35.8 27.61,16.42 v27.11,15.92
USB+
  Top 0.152: U$1.D+ 23.99,6.21 23.39,6.81 23.39,7.21 | R15.1 23.39,7.21 | C5.1 22.29,8.41 22.49,8.21 22.49,7.51 22.79,7.21 23.39,7.21
USB-  (via drill 0.3 pad 0.55)
  Top 0.152: C8.1 25.72,6.81 25.27,7.26 R12.1 v24.59,6.45 | U$1.D- 23.34,5.9 v22.79,6.45
  Bottom 0.152: v24.59,6.45 v24.58,6.45 v22.79,6.45
USBDM
  Top 0.152: R12.2 24.59,8.71 24.49,8.81 FT231XQ.9
USBDP
  Top 0.152: R15.2 23.39,8.71 23.99,9.31 FT231XQ.8
VBAT  (via drill 0.3)
  Top 0.254: 17.23,14.36 17.54,14.05 U1.15 U1.14 | U1.16 17.23,14.36 | LIPO.VCC 2.81,21.93 | 2.81,21.93 4.67,21.93 5.58,21.02 5.58,20.98 12.41,20.98 13.88,22.44 v15.91,22.44 | 2.81,21.93 2.79,21.95 2.79,29.21 3.49,29.91 8.48,29.91 9.48,30.91 9.48,40.9 9.96,41.38 11.65,41.38 R25.2 | C11.1 17.78,14.91 17.23,14.36
  Bottom 0.254: v15.91,22.44 17,22.44 17.78,21.66 C11.1
  other vias: 17.78,18
VCCIO1  (via drill 0.3 pad 0.55)
  Top 0.152: C16.1 26.49,8.41 | 26.49,8.41 25.69,8.41 24.99,9.11 FT231XQ.10 | 26.49,8.41 27.09,9.01 27.09,11.01 26.79,11.31 FT231XQ.11 26.34,11.31 26.34,10.61 v26.04,10.31 | v21.64,14.31 21.79,14.46 22.89,14.46 FT231XQ.20
  Bottom 0.152: v26.04,10.31 21.99,10.31 21.34,10.96 21.34,14.01 v21.64,14.31
VIN  (via drill 0.3, 0.3 pad 0.55)
  Top 0.254: U$2.5 8.04,16.86 8.74,17.56 12.24,17.56 12.69,18.01 C9.1 C6.1 | TPS61090.8 v33.69,12.01 33.99,12.01 34.99,11.01 36.56,11.01 37.87,9.7 L1.1 37.89,8.49 37.89,12.21 36.89,13.21 R7.2 36.39,13.71 35.67,14.43 TPS61090.11
  Bottom 0.254: v33.69,12.01 30.45,12.01 28.31,14.14 26.35,14.14 25.53,14.96 16.24,14.96 14.41,16.79 C9.1
  other vias: 14.41,18.01
VPCC  (via drill 0.3 pad 0.55)
  Top 0.152: R5.1 9.89,12.69 10.89,11.69 R8.1 v11.69,11.61 | v12.09,13.01 12.59,13.01 12.79,12.81 U1.2
  Bottom 0.152: v11.69,11.61 11.69,12.61 v12.09,13.01
VSHARE  (via drill 0.3 pad 0.55)
  Top 0.254: U$2.1 U$12.6 9.44,19.83 9.94,20.32 12.39,20.32 | R11.1 12.49,13.81 12.99,13.31 U1.1 13.44,13.98 13.66,14.2 | U1.20 13.82,14.36 13.66,14.2 | 12.39,20.32 v12.39,18.91 | v12.41,16.44 12.41,15.45 13.66,14.2 | 12.39,20.32 12.4,20.32 13.31,21.23 14.37,21.23 C2.1
  Bottom 0.254: v12.39,18.91 12.39,16.46 v12.41,16.44
VUSB  (via drill 0.3 pad 0.55)
  Top 0.254: C4.1 22.69,5.58 U$1.VUSB 22.69,4.31 | CHARGE.1 18.42,2.53 19.59,3.71 22.09,3.71 22.69,4.31 | R5.2 11.29,12.31 U1.3 U1.4 12.69,11.81 12.46,11.58 v12.46,11.09 | v18.49,6.81 18.49,7.81 16.94,9.36 16.19,9.36 15.99,9.57 U1.9 | DONE.1 29.29,2.51 28.11,3.69 23.2,3.69 22.69,4.2 22.69,4.31 | U1.17 U1.18 U1.19 14.99,15.01 14.79,15.21 v14.09,15.21 | FT231XQ.12 27.24,11.81 28.23,10.82 v28.23,9.57
  Bottom 0.254: v28.23,9.57 28.23,8.61 27.31,7.69 22.35,7.69 C4.1 v18.49,6.81 16.15,6.81 12.46,10.5 v12.46,11.09 12.46,11.66 13.56,12.77 13.56,14.68 v14.09,15.21
  other vias: 21.47,6.81
Y0
  Top 0.152: R18.1 10.83,25.07 11.7,25.07 U$20.6 U$22.1
(copper drawn outside any net)
  shapes: Top area x2

### Text on the board
tPlace: BUZZER | MOT. | LIPO
bPlace: MOT. | SmartBall v2.1 | LIPO
tNames: CHARGE | DONE
tDocu: SPECIFICATIONS ----------------------- / / FR-4 / TG 130-140 / 1.2 mm thickness (1 mm possible) / 6 mil width with 6 mil clearance / 0.3 mm vias / White mask / Back Silkscreen / 2 oz Cu (1 oz Cu possible) / / TRACE WIDTH -------------------------- / / 12 mil : GND,Vin,Vshare,Vusb, +5V / 08 mil : +3.3V / 06 mil : others